# EAGLE design displayboard (EAGLE 5.10)
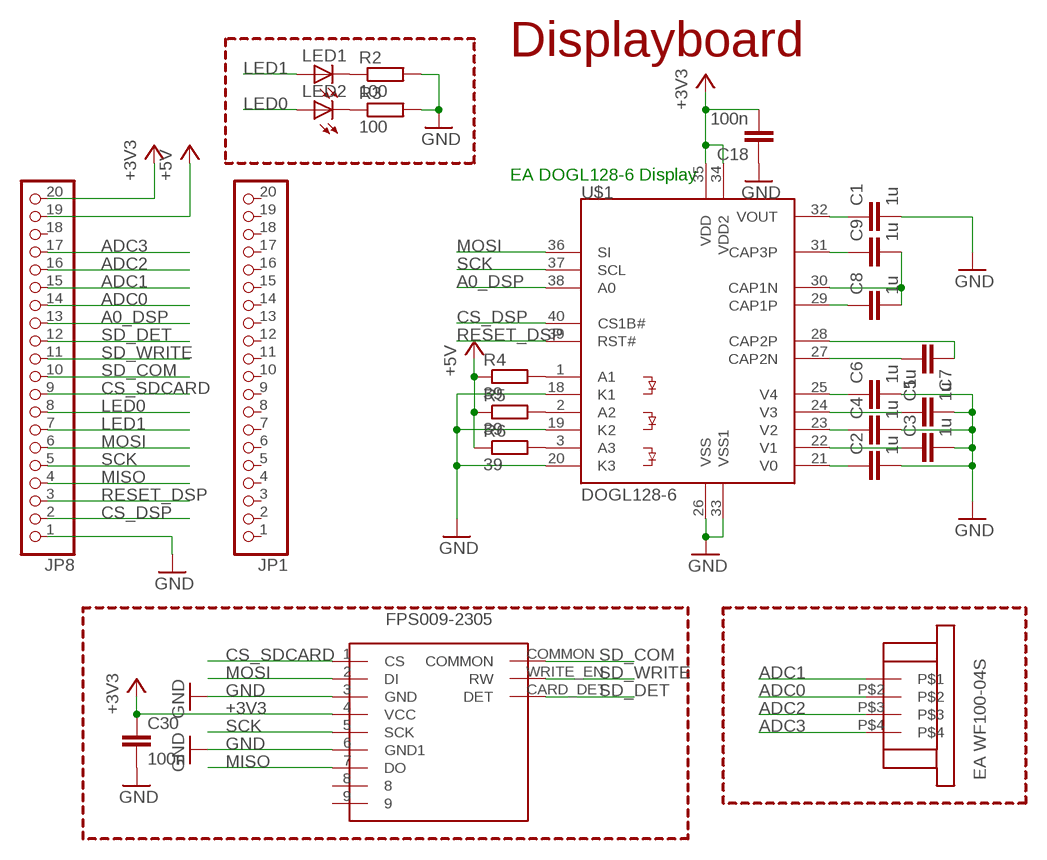
[diagram p0: schematic, sheet 1]

## Parts
C1  1u  C-EUC0805  [C0805]
C2  1u  C-EUC0805  [C0805]
C3  1u  C-EUC0805  [C0805]
C4  1u  C-EUC0805  [C0805]
C5  1u  C-EUC0805  [C0805]
C6  1u  C-EUC0805  [C0805]
C7  1u  C-EUC0805  [C0805]
C8  1u  C-EUC0805  [C0805]
C9  1u  C-EUC0805  [C0805]
C18  100n  C-EUC0805  [C0805]
C30  100n  C-EUC0805  [C0805]
JP1  PINHD-1X20  [1X20]
JP8  PINHD-1X20  [1X20]
LED1  LEDCHIPLED_0805  [CHIPLED_0805]
LED2  LEDCHIPLED_0805  [CHIPLED_0805]
R2  100  R-EU_R0805  [R0805]
R3  100  R-EU_R0805  [R0805]
R4  39  R-EU_R0805  [R0805]
R5  39  R-EU_R0805  [R0805]
R6  39  R-EU_R0805  [R0805]
U$1  DOGL128-6  [DOGL128]
U$2  EAWF100-04S  [EAWF100-04S]
U$3  FPS009-2305  [FPS009-2305]

## Nets
+3V3: C18.2 C30.1 JP8.20 U$1.34(VDD2) U$1.35(VDD) U$3.4(VCC)
+5V: JP8.19 R4.1 R5.1 R6.1
A0_DSP: JP8.13 U$1.38(A0)
ADC0: JP8.14 U$2.P$2
ADC1: JP8.15 U$2.P$1
ADC2: JP8.16 U$2.P$3
ADC3: JP8.17 U$2.P$4
CS_DSP: JP8.2 U$1.40(CS1B#)
CS_SDCARD: JP8.9 U$3.1(CS)
GND: C1.2 C2.2 C3.2 C4.2 C5.2 C6.2 C18.1 C30.2 JP8.1 R2.2 R3.2 U$1.18(K1) U$1.19(K2) U$1.20(K3) U$1.26(VSS) U$1.33(VSS1) U$3.3(GND) U$3.6(GND1)
LED0: JP8.8 LED2.A
LED1: JP8.7 LED1.A
MISO: JP8.4 U$3.7(DO)
MOSI: JP8.6 U$1.36(SI) U$3.2(DI)
N$1: LED1.C R2.1
N$3: C2.1 U$1.21(V0)
N$4: C3.1 U$1.22(V1)
N$5: C4.1 U$1.23(V2)
N$6: C5.1 U$1.24(V3)
N$7: C6.1 U$1.25(V4)
N$8: LED2.C R3.1
N$9: C7.2 U$1.27(CAP2N)
N$10: C7.1 U$1.28(CAP2P)
N$11: C8.1 U$1.29(CAP1P)
N$12: C8.2 C9.2 U$1.30(CAP1N)
N$13: C9.1 U$1.31(CAP3P)
N$14: C1.1 U$1.32(VOUT)
N$17: R4.2 U$1.1(A1)
N$18: R5.2 U$1.2(A2)
N$22: R6.2 U$1.3(A3)
RESET_DSP: JP8.3 U$1.39(RST#)
SCK: JP8.5 U$1.37(SCL) U$3.5(SCK)
SD_COM: JP8.10 U$3.COMMON
SD_DET: JP8.12 U$3.CARD_DET(DET)
SD_WRITE: JP8.11 U$3.WRITE_EN(RW)
Unconnected: JP1.1 JP1.2 JP1.3 JP1.4 JP1.5 JP1.6 JP1.7 JP1.8 JP1.9 JP1.10 JP1.11 JP1.12 JP1.13 JP1.14 JP1.15 JP1.16 JP1.17 JP1.18 JP1.19 JP1.20 JP8.18 U$3.8 U$3.9

## Notes on the sheet
- Displayboard
- EA DOGL128-6 Display

## Library data of the parts
C1-C9 C18 C30 = rcl:C-EU: CAPACITOR, European symbol
JP1 JP8 = pinhead:PINHD-1X20: PIN HEADER
LED1 LED2 = led:LED: LED OSRAM: - CHIPLED LG R971, LG N971, LY N971, LG Q971, LY Q971, LO R971, LY R971 LH N974, LH R974 LS Q976, LO Q976, LY Q976 LO Q996 - Hyper CHIPLED LW Q18S LB Q993, LB Q99A, LB R99A - SideLED LS A670, LO A670, LY A670, LG A670, LP A670 LB A673, LV A673, LT A673, LW A673 LH A674 LY A675 LS A676, LA A676, LO A676, LY A676, LW A676 LS A679, LY A679, LG A679 - Hyper Micro SIDELED® LS Y876, LA Y876, LO Y876, LY Y876 LT Y87S - SmartLED LW L88C, LW L88S LB L89C, LB L89S, LG L890 LS L89K, LO L89K, LY L89K LS L896, LA L896, LO L896, LY L896 - TOPLED LS T670, LO T670, LY T670, LG T670, LP T670 LSG T670, LSP T670, LSY T670, LOP T670, LYG T670 LG T671, LOG T671, LSG T671 LB T673, LV T673, LT T673, LW T673 LH T674 LS T676, LA T676, LO T676, LY T676, LB T676, LH T676, LSB T676, LW T676 LB T67C, LV T67C, LT T67C, LS T67K, LO T67K, LY T67K, LW E67C LS E67B, LA E67B, LO E67B, LY E67B, LB E67C, LV E67C, LT E67C LW T67C LS T679, LY T679, LG T679 LS T770, LO T770, LY T770, LG T770, LP T770 LB T773, LV T773, LT T773, LW T773 LH T774 LS E675, LA E675, LY E675, LS T675 LS T776, LA T776, LO T776, LY T776, LB T776 LHGB T686 LT T68C, LB T68C - Hyper Mini TOPLED® LB M676 - Mini TOPLED Santana® LG M470 LS M47K, LO M47K, LY M47K Source: http://www.osram.convergy.de LUXEON: - LUMILED® LXK2-PW12-R00, LXK2-PW12-S00, LXK2-PW14-U00, LXK2-PW14-V00 LXK2-PM12-R00, LXK2-PM12-S00, LXK2-PM14-U00 LXK2-PE12-Q00, LXK2-PE12-R00, LXK2-PE12-S00, LXK2-PE14-T00, LXK2-PE14-U00 LXK2-PB12-K00, LXK2-PB12-L00, LXK2-PB12-M00, LXK2-PB14-N00, LXK2-PB14-P00, LXK2-PB14-Q00 LXK2-PR12-L00, LXK2-PR12-M00, LXK2-PR14-Q00, LXK2-PR14-R00 LXK2-PD12-Q00, LXK2-PD12-R00, LXK2-PD12-S00 LXK2-PH12-R00, LXK2-PH12-S00 LXK2-PL12-P00, LXK2-PL12-Q00, LXK2-PL12-R00 Source: www.luxeon.com KINGBRIGHT: KA-3528ASYC Source: www.kingbright.com
R2-R6 = rcl:R-EU_: RESISTOR, European symbol
U$1 = lcd_displays:DOGL128-6
U$2 = ea_wf100:EAWF100-04S: EA WF100-04S: Connector for the Touchscreenpanel for the EA DOGX-128 series
U$3 = yamaichi:FPS009-2305: YAMAICHI FPS009-2305 SD,MMC slot

## Board
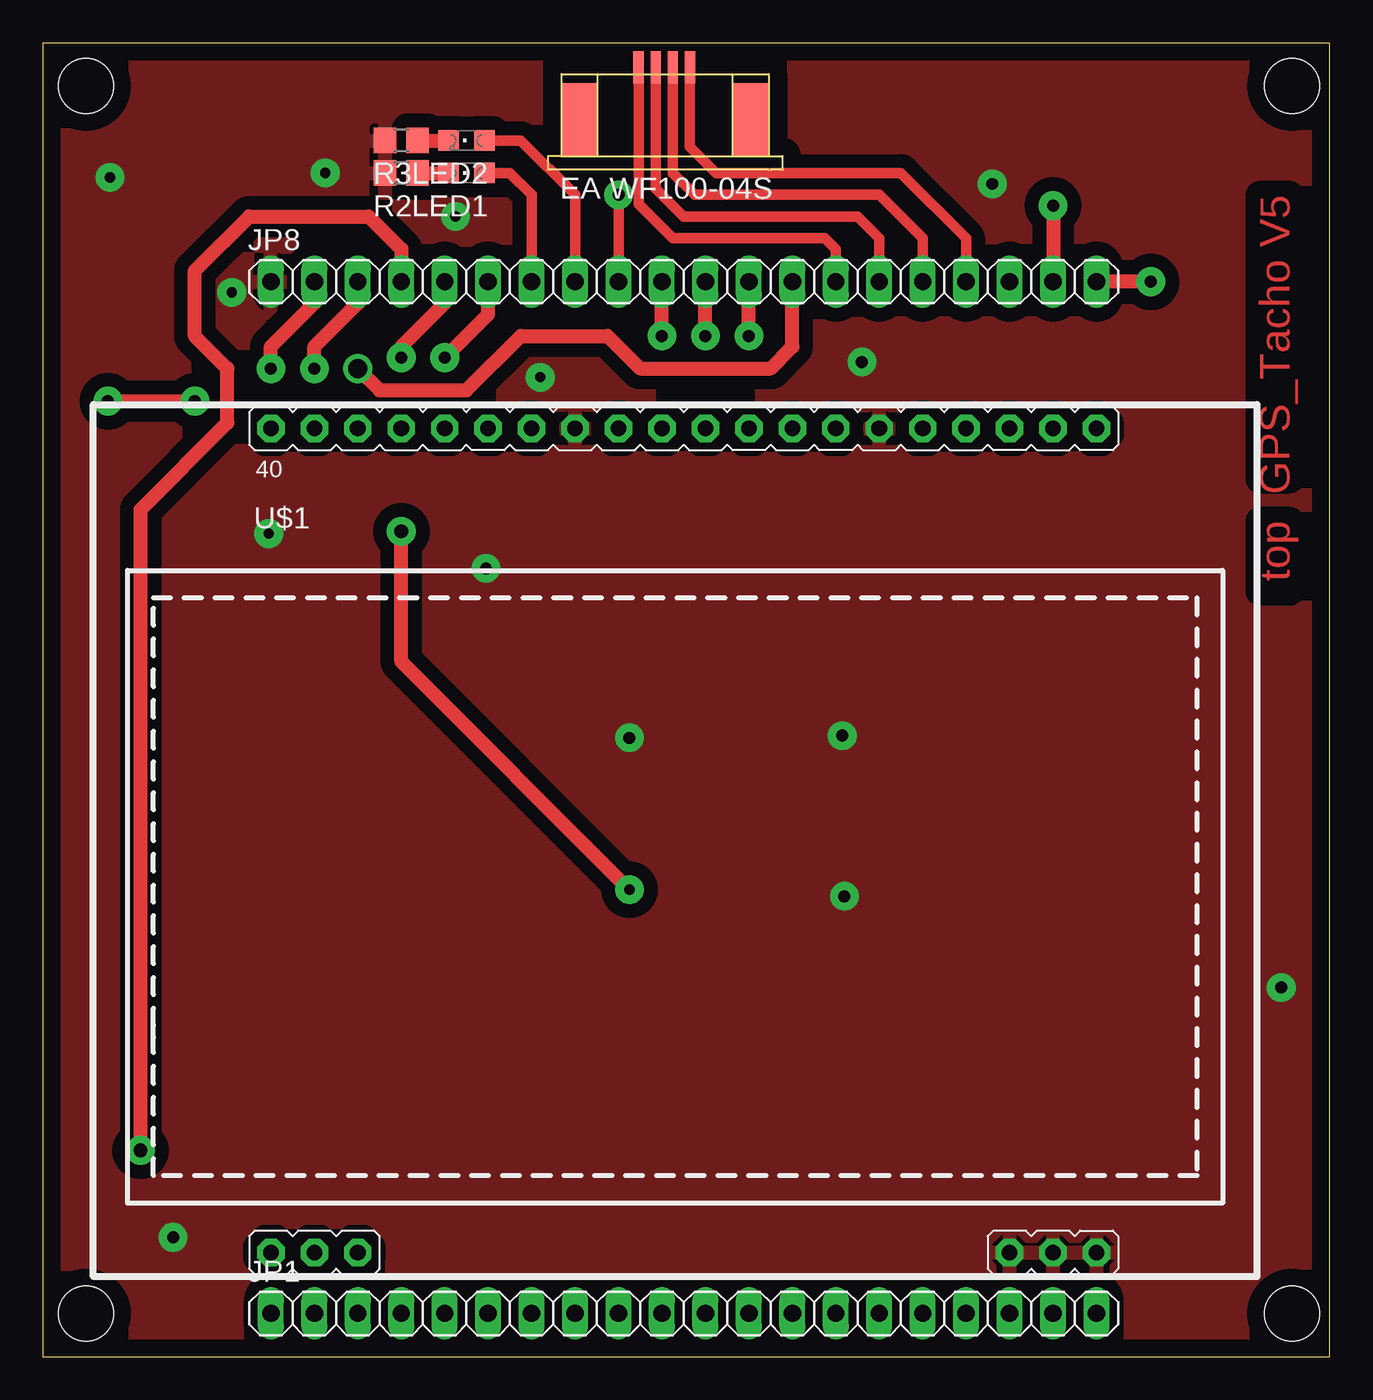
[diagram p1: board, top side]
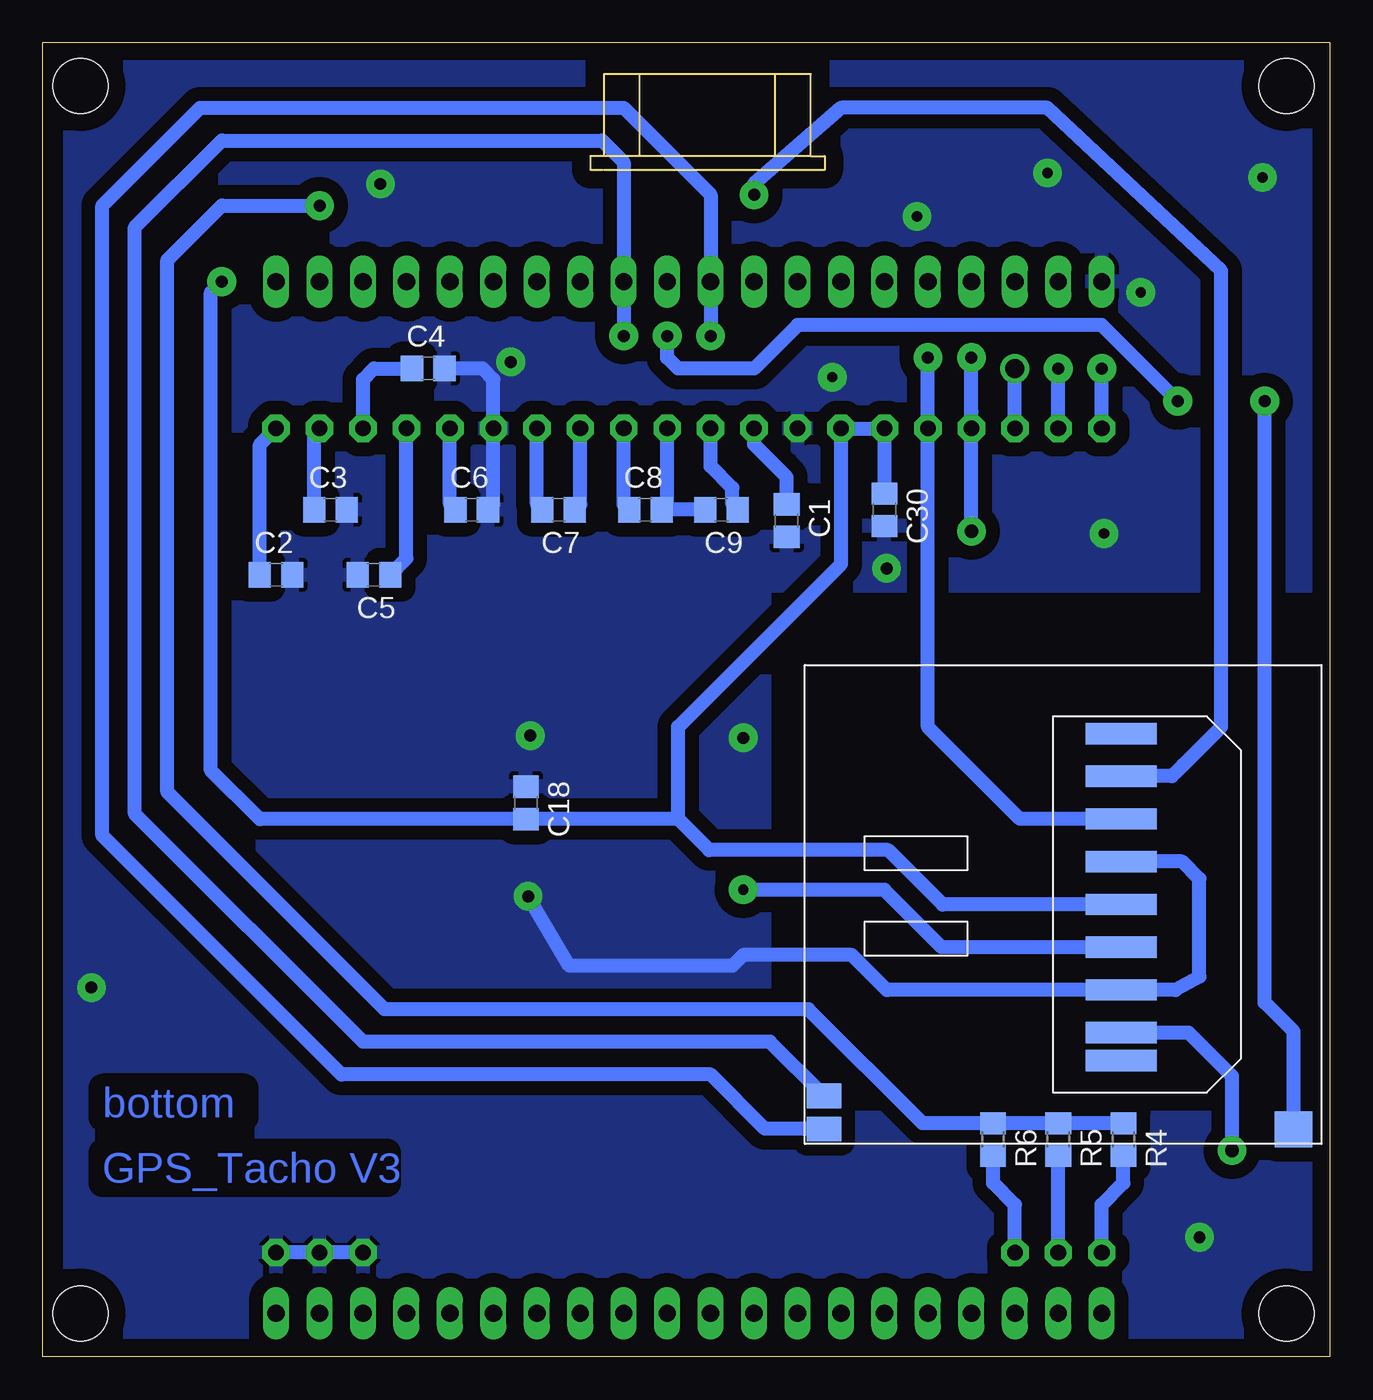
[diagram p2: board, bottom side, seen from below]

Size 75.23 x 76.83 mm. Coordinates in mm from the lower left corner, seen from the top.
Outline: 75.23,76.83 75.23,0 0,0 0,76.83
Outline: 0,76.83 75.23,76.83
Copper layers (1*16): Top 0.035mm / dielectric 1.5mm / Bottom 0.035mm
Design rules "default": minimum track width 10mil, minimum drill 24mil, track to track 8mil, track to pad 8mil, pad to pad 8mil, via to via 8mil, smd to smd 8mil, copper to edge 40mil, drill to drill 8mil, minimum pad ring 10mil, minimum via ring 8mil, stop-mask expansion 4mil, vias tented up to drill 0mil, thermal gap 10mil
Holes 3.2 mm at 2.54,74.3 73.03,74.3 2.54,2.54 73.03,2.54

### Footprints (pad centres in the part's own frame; a part is rotated, then mirrored left to right if it is on the bottom)
C0805 = smd 1.3 x 1.5: 1 -0.95,0; 2 0.95,0
1X20 = drill 1.016 long: 1 -24.13,0; 2 -21.59,0; 3 -19.05,0; 4 -16.51,0; 5 -13.97,0; 6 -11.43,0; 7 -8.89,0; 8 -6.35,0; 9 -3.81,0; 10 -1.27,0; 11 1.27,0; 12 3.81,0; 13 6.35,0; 14 8.89,0; 15 11.43,0; 16 13.97,0; 17 16.51,0; 18 19.05,0; 19 21.59,0; 20 24.13,0
CHIPLED_0805 = smd 1.2 x 1.2: A 0,-1.05; C 0,1.05
R0805 = smd 1.3 x 1.5: 1 -0.95,0; 2 0.95,0
DOGL128 = drill 0.914 pad 1.6 octagon: 1 -24.13,-26.92; 2 -21.59,-26.92; 3 -19.05,-26.92; 18 19.05,-26.92; 19 21.59,-26.92; 20 24.13,-26.92; 21 24.13,21.26; 22 21.59,21.26; 23 19.05,21.26; 24 16.51,21.26; 25 13.97,21.26; 26 11.43,21.26; 27 8.89,21.26; 28 6.35,21.26; 29 3.81,21.26; 30 1.27,21.26; 31 -1.27,21.26; 32 -3.81,21.26; 33 -6.35,21.26; 34 -8.89,21.26; 35 -11.43,21.26; 36 -13.97,21.26; 37 -16.51,21.26; 38 -19.05,21.26; 39 -21.59,21.26; 40 -24.13,21.26
EAWF100-04S = smd 0.6 x 1.85: P$1 -1,2; P$2 -2,2; P$3 0,2; P$4 1,2 | smd 2.1 x 4.3: P$5 -5.5,-1.1; P$6 4.5,-1.1
FPS009-2305 = smd 4.15 x 1.25: 1 0,-2.5; 2 0,-5; 3 0,-7.5; 4 0,-10; 5 0,-12.5; 6 0,-15; 7 0,-17.5; 8 0,-19.125; 9 0,-0.03 | smd 2 x 1.45: CARD_DET -17.375,-21.2; COMMON -17.375,-23.14 | smd 2.2 x 2.1: WRITE_EN 10.075,-23.14

### Placement (x,y rotation side)
C1  31.75,48.9 270 bottom
C2  61.59,45.72 0 bottom
C3  58.42,49.53 0 bottom
C4  52.7,57.78 0 bottom
C5  55.88,45.72 180 bottom
C6  50.16,49.53 0 bottom
C7  45.09,49.53 180 bottom
C8  40.01,49.53 0 bottom
C9  35.56,49.53 180 bottom
C18  46.99,32.38 270 bottom
C30  26.04,49.53 270 bottom
JP1  37.47,2.54 0 top
JP8  37.47,62.87 0 top
LED1  24.77,69.22 90 top
LED2  24.77,71.12 90 top
R2  20.95,69.22 180 top
R3  20.95,71.12 180 top
R4  12.06,12.7 270 bottom
R5  15.88,12.7 270 bottom
R6  19.68,12.7 270 bottom
U$1  37.47,33.02 0 top
U$2  36.83,73.41 0 top
U$3  12.19,36.45 0 bottom

### Tracks (layer width: path | path; a pad name or v marks a point on that pad's centre or on a via)
+3V3  (via drill 0.7 pad 1.68)
  Top 0.813: v64.77,62.87 JP8.20
  Bottom 0.813: C30.1 U$1.35 U$1.34 28.57,46.35 38.1,36.83 38.1,31.43 | 38.1,31.43 C18.2 62.55,31.43 65.41,34.29 65.41,62.23 v64.77,62.87 | 38.1,31.43 36.29,29.62 25.81,29.62 22.64,26.45 U$3.4
+5V  (via drill 0.7 pad 1.68)
  Top 0.813: v59.05,67.31 JP8.19
  Bottom 0.813: R4.1 R5.1 R6.1 23.81,13.65 30.48,20.32 55.24,20.32 67.94,33.02 67.94,64.14 64.77,67.31 v59.05,67.31
A0_DSP  (via drill 1.1 pad 1.68)
  Top 0.813: 43.81,61.59 JP8.13 43.81,59.05 42.55,57.78 34.92,57.78 33.02,59.69 27.94,59.69 24.77,56.52 19.68,56.52 v18.41,57.78
  Bottom 0.813: U$1.38 v18.41,57.78
ADC0
  Top 0.61: JP8.14 46.35,64.77 45.72,65.41 36.83,65.41 34.83,67.41 U$2.P$2
ADC1
  Top 0.61: JP8.15 48.9,65.41 47.62,66.67 37.47,66.67 35.83,68.31 U$2.P$1
ADC2
  Top 0.61: JP8.16 51.44,65.41 48.9,67.94 38.1,67.94 36.83,69.22 U$2.P$3
ADC3
  Top 0.61: JP8.17 53.98,65.41 50.16,69.22 39.37,69.22 37.83,70.75 U$2.P$4
CS_DSP  (via drill 0.7 pad 1.68)
  Top 0.813: JP8.2 15.88,61.59 13.34,59.05 v13.34,57.78
  Bottom 0.813: U$1.40 v13.34,57.78
CS_SDCARD  (via drill 0.7 pad 1.68)
  Top 0.61: v33.66,67.94 JP8.9
  Bottom 0.61: 33.66,68.58 v33.66,67.94
  Bottom 0.813: 33.66,68.58 28.57,73.03 16.51,73.03 6.35,63.5 6.35,36.83 8.57,34.61 8.89,34.29 9.23,33.95 U$3.1
GND  (via drill 0.6 pad 1.68, 0.7 pad 1.68)
  Bottom 0.813: U$1.18 U$1.19 U$1.20 | C4.2 49.53,57.78 48.9,57.15 U$1.26 48.9,49.85 C6.2 | v46.86,26.92 44.45,22.86 34.92,22.86 34.29,23.5 27.94,23.5 25.89,21.45 U$3.6 9.03,21.45 7.62,22.23 7.62,27.94 8.63,28.95 U$3.3
  other vias: 3.94,68.96 46.74,36.32 25.91,46.1 55.5,68.58 11.05,62.23 24.13,66.67 29.08,57.28 13.21,48.13 47.88,58.17 16.51,69.22 34.29,36.2 7.62,6.99 72.39,21.59
  pour Top (isolate 0.813): 0,76.83 74.3,76.83 74.3,0 0,0
  pour Bottom (isolate 0.813): 0.64,76.83 73.66,76.83 73.66,0 0.64,-1.27 0.64,13.97 33.02,13.97 33.02,45.09 0.64,45.09
LED0
  Top 0.61: LED2.A 27.94,71.12 31.11,67.94 JP8.8
LED1
  Top 0.61: LED1.A 27.3,69.22 28.57,67.94 JP8.7
MISO  (via drill 0.8 pad 1.68)
  Top 0.813: JP8.4 20.95,64.77 19.05,66.67 12.06,66.67 8.89,63.5 8.89,59.69 10.79,57.78 10.79,54.61 5.71,49.53 v5.71,12.06
  Bottom 0.813: U$3.7 8.26,18.95 5.71,16.41 v5.71,12.06
MOSI  (via drill 0.7 pad 1.68)
  Top 0.813: JP8.6 26.04,60.96 v23.5,58.42
  Bottom 0.813: v23.5,58.42 U$1.36 23.5,36.83 18.11,31.45 U$3.2
N$1
  Top 0.813: R2.1 LED1.C
N$3
  Bottom 0.813: C2.1 62.55,53.33 U$1.21
N$4
  Bottom 0.813: C3.1 59.37,53.97 U$1.22
N$5
  Bottom 0.813: C4.1 55.88,57.78 56.52,57.15 U$1.23
N$6
  Bottom 0.813: U$1.24 53.98,46.67 C5.1
N$7
  Bottom 0.813: U$1.25 51.44,49.85 C6.1
N$8
  Top 0.813: R3.1 LED2.C
N$9
  Bottom 0.813: U$1.27 46.35,49.85 C7.2
N$10
  Bottom 0.813: U$1.28 43.81,49.85 C7.1
N$11
  Bottom 0.813: U$1.29 41.27,49.85 C8.1
N$12
  Bottom 0.813: C9.2 C8.2 38.73,49.85 U$1.30
N$13
  Bottom 0.813: U$1.31 36.2,52.07 34.92,50.8 34.92,49.84 C9.1
N$14
  Bottom 0.813: U$1.32 33.66,53.34 31.75,51.44 C1.1
N$17
  Bottom 0.813: U$1.1 13.34,8.89 12.06,10.16 R4.2
N$18
  Bottom 0.813: U$1.2 R5.2
N$22
  Bottom 0.813: U$1.3 18.41,8.89 19.68,10.16 R6.2
RESET_DSP  (via drill 0.7 pad 1.68)
  Top 0.813: JP8.3 18.41,61.59 15.88,59.05 v15.88,57.78
  Bottom 0.813: U$1.39 v15.88,57.78
SCK  (via drill 0.6 pad 1.68, 0.7 pad 1.68, 0.8 pad 1.68)
  Top 0.813: JP8.5 23.5,61.59 20.95,59.05 v20.95,58.42 | v20.95,48.26 20.95,40.64 v34.29,27.3
  Bottom 0.813: U$1.37 20.95,54.61 | U$1.37 20.95,55.24 | U$1.37 v20.95,58.42 | v20.95,48.26 U$1.37 | v34.29,27.3 26.04,27.3 22.68,23.95 U$3.5
SD_COM  (via drill 0.7 pad 1.68)
  Top 0.813: v36.2,59.69 JP8.10
  Bottom 0.813: v36.2,59.69 36.2,67.94 41.27,73.03 66.04,73.03 71.75,67.31 71.75,30.48 57.78,16.51 36.2,16.51 33.02,13.34 29.59,13.34 U$3.COMMON
SD_DET  (via drill 0.7 pad 1.68)
  Top 0.813: v41.27,59.69 JP8.12
  Bottom 0.813: v41.27,59.69 41.27,69.85 42.55,71.12 64.77,71.12 69.85,66.04 69.85,31.75 56.52,18.41 32.73,18.41 U$3.CARD_DET
SD_WRITE  (via drill 0.7 pad 1.68)
  Top 0.813: v38.73,59.69 JP8.11 | v3.81,55.88 v8.89,55.88
  Bottom 0.813: v38.73,59.69 38.73,58.42 38.1,57.78 33.66,57.78 31.11,60.33 13.34,60.33 v8.89,55.88 | v3.81,55.88 3.81,20.72 2.12,19.02 U$3.WRITE_EN

### Text on the board
Top: GPS_Tacho V5 | top
Bottom: bottom | GPS_Tacho V3